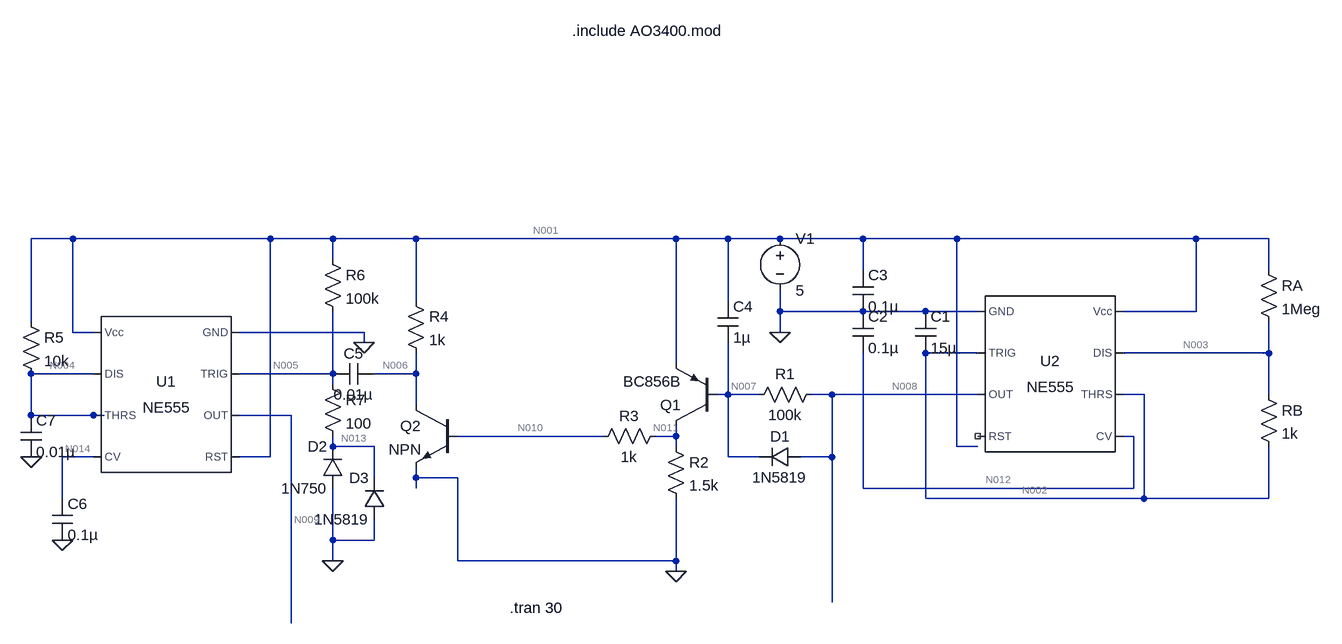
[diagram p0: schematic oscillator.asc]
oscillator.asc, the LTspice schematic file:
Version 4.1
SHEET 1 956 680
WIRE -992 -384 -1056 -384
WIRE -688 -384 -992 -384
WIRE -592 -384 -688 -384
WIRE -464 -384 -592 -384
WIRE -64 -384 -464 -384
WIRE 16 -384 -64 -384
WIRE 96 -384 16 -384
WIRE 224 -384 96 -384
WIRE 368 -384 224 -384
WIRE 736 -384 368 -384
WIRE 848 -384 736 -384
WIRE -592 -352 -592 -384
WIRE 224 -336 224 -384
WIRE 848 -336 848 -384
WIRE -464 -288 -464 -384
WIRE 16 -288 16 -384
WIRE 96 -272 96 -304
WIRE 224 -272 96 -272
WIRE 320 -272 224 -272
WIRE 400 -272 320 -272
WIRE 736 -272 736 -384
WIRE 736 -272 624 -272
WIRE -1056 -256 -1056 -384
WIRE -992 -240 -992 -384
WIRE -960 -240 -992 -240
WIRE -544 -240 -736 -240
WIRE 96 -240 96 -272
WIRE -544 -224 -544 -240
WIRE 400 -208 320 -208
WIRE 848 -208 848 -256
WIRE 848 -208 624 -208
WIRE -64 -192 -64 -384
WIRE -960 -176 -1056 -176
WIRE -592 -176 -592 -272
WIRE -592 -176 -736 -176
WIRE -464 -176 -464 -208
WIRE -464 -176 -528 -176
WIRE -592 -160 -592 -176
WIRE 16 -144 16 -224
WIRE 16 -144 0 -144
WIRE 64 -144 16 -144
WIRE 176 -144 144 -144
WIRE 400 -144 176 -144
WIRE 656 -144 624 -144
WIRE 848 -144 848 -208
WIRE -464 -128 -464 -176
WIRE -1056 -112 -1056 -176
WIRE -960 -112 -1056 -112
WIRE -944 -112 -960 -112
WIRE -656 -112 -736 -112
WIRE -176 -80 -400 -80
WIRE -64 -80 -64 -96
WIRE -64 -80 -96 -80
WIRE 640 -80 624 -80
WIRE -592 -64 -592 -80
WIRE -528 -64 -592 -64
WIRE -64 -64 -64 -80
WIRE 368 -64 368 -384
WIRE 400 -64 368 -64
WIRE -960 -48 -1008 -48
WIRE -688 -48 -688 -384
WIRE -688 -48 -736 -48
WIRE 16 -48 16 -144
WIRE 64 -48 16 -48
WIRE 176 -48 176 -144
WIRE 176 -48 128 -48
WIRE -528 -16 -528 -64
WIRE -464 -16 -464 -32
WIRE -400 -16 -464 -16
WIRE -464 0 -464 -16
WIRE 224 0 224 -208
WIRE 640 0 640 -80
WIRE 640 0 224 0
WIRE -1008 16 -1008 -48
WIRE 320 16 320 -208
WIRE 656 16 656 -144
WIRE 656 16 320 16
WIRE 848 16 848 -64
WIRE 848 16 656 16
WIRE -592 80 -592 0
WIRE -528 80 -528 48
WIRE -528 80 -592 80
WIRE -592 112 -592 80
WIRE -400 112 -400 -16
WIRE -64 112 -64 16
WIRE -64 112 -400 112
WIRE -64 128 -64 112
WIRE 176 176 176 -48
WIRE -656 208 -656 -112
FLAG 96 -240 0
FLAG -64 128 0
FLAG -544 -224 0
FLAG -1008 80 0
FLAG -1056 -48 0
FLAG -592 112 0
SYMBOL Misc\\NE555 512 -176 R0
SYMATTR InstName U2
SYMBOL cap 304 -272 R0
SYMATTR InstName C1
SYMATTR Value 15µ
SYMBOL res 832 -160 R0
SYMATTR InstName RB
SYMATTR Value 1k
SYMBOL res 832 -352 R0
SYMATTR InstName RA
SYMATTR Value 1Meg
SYMBOL cap 208 -272 R0
SYMATTR InstName C2
SYMATTR Value 0.1µ
SYMBOL cap 208 -336 R0
SYMATTR InstName C3
SYMATTR Value 0.1µ
SYMBOL voltage 96 -400 R0
WINDOW 123 0 0 Left 0
WINDOW 39 0 0 Left 0
SYMATTR InstName V1
SYMATTR Value 5
SYMBOL res 160 -160 R90
WINDOW 0 0 56 VBottom 2
WINDOW 3 32 56 VTop 2
SYMATTR InstName R1
SYMATTR Value 100k
SYMBOL cap 0 -288 R0
SYMATTR InstName C4
SYMATTR Value 1µ
SYMBOL res -80 -80 R0
SYMATTR InstName R2
SYMATTR Value 1.5k
SYMBOL pnp 0 -96 R180
SYMATTR InstName Q1
SYMATTR Value BC856B
SYMBOL npn -400 -128 M0
SYMATTR InstName Q2
SYMBOL res -80 -96 R90
WINDOW 0 0 56 VBottom 2
WINDOW 3 32 56 VTop 2
SYMATTR InstName R3
SYMATTR Value 1k
SYMBOL res -480 -304 R0
SYMATTR InstName R4
SYMATTR Value 1k
SYMBOL diode 128 -64 R90
WINDOW 0 0 32 VBottom 2
WINDOW 3 32 32 VTop 2
SYMATTR InstName D1
SYMATTR Value 1N5819
SYMBOL Misc\\NE555 -848 -144 M0
SYMATTR InstName U1
SYMBOL cap -1024 16 R0
SYMATTR InstName C6
SYMATTR Value 0.1µ
SYMBOL res -1072 -272 R0
SYMATTR InstName R5
SYMATTR Value 10k
SYMATTR SpiceLine tol=10
SYMBOL cap -1072 -112 R0
SYMATTR InstName C7
SYMATTR Value 0.01µ
SYMBOL cap -528 -192 R90
WINDOW 0 0 32 VBottom 2
WINDOW 3 32 32 VTop 2
SYMATTR InstName C5
SYMATTR Value 0.01µ
SYMATTR SpiceLine V=4 Irms=162m Rser=0.395426 Lser=0 mfg="KEMET" pn="C0402C103K7PAC" type="X5R"
SYMBOL res -608 -368 R0
SYMATTR InstName R6
SYMATTR Value 100k
SYMATTR SpiceLine tol=10
SYMBOL diode -576 0 R180
WINDOW 0 24 64 Left 2
WINDOW 3 24 0 Left 2
SYMATTR InstName D2
SYMATTR Value 1N750
SYMBOL res -608 -176 R0
SYMATTR InstName R7
SYMATTR Value 100
SYMBOL diode -512 48 R180
WINDOW 0 24 64 Left 2
WINDOW 3 24 0 Left 2
SYMATTR InstName D3
SYMATTR Value 1N5819
SYMATTR Description Diode
SYMATTR Type diode
TEXT -224 -704 Left 2 !.include AO3400.mod
TEXT -320 184 Left 2 !.tran 30

The netlist it stands for:
* oscillator.asc
X§U2 0 N002 N008 NC_01 N012 N002 N003 N001 NE555  ; pins GND TRIG OUT RST CV THRS DIS Vcc
C1 0 N002 15µ
RB N003 N002 1k
RA N001 N003 1Meg
C2 0 N012 0.1µ
C3 N001 0 0.1µ
V1 N001 0 5
R1 N008 N007 100k
C4 N001 N007 1µ
R2 N011 0 1.5k
Q1 N011 N007 N001 0 BC856B
Q2 N006 N010 0 0 NPN
R3 N011 N010 1k
R4 N001 N006 1k
D1 N008 N007 1N5819
X§U1 0 N005 N009 N001 N014 N004 N004 N001 NE555  ; pins GND TRIG OUT RST CV THRS DIS Vcc
C6 N014 0 0.1µ
R5 N001 N004 10k tol=10
C7 N004 0 0.01µ
C5 N006 N005 0.01µ V=4 Irms=162m Rser=0.395426 Lser=0 mfg="KEMET" pn="C0402C103K7PAC" type="X5R"
R6 N001 N005 100k tol=10
D2 0 N013 1N750
R7 N005 N013 100
D3 0 N013 1N5819
.model D D
.lib standard.dio
.model NPN NPN
.model PNP PNP
.lib standard.bjt
.include AO3400.mod
.tran 30
.lib NE555.sub
.backanno
.end

* Results of the author's LTspice run, read from the files saved beside the schematic
* Operating Point, zero values left out:
*   V(n001) = 5 V
*   V(n002) = 4.983 V
*   V(n003) = 4.983 V
*   V(n004) = 5 V
*   V(n005) = 1.737 V
*   V(n006) = 5 V
*   V(n007) = 5 V
*   V(n008) = 5 V
*   V(n009) = 5 V
*   V(n010) = 20.06 nV
*   V(n011) = 15.06 nV
*   V(n012) = 3.333 V
*   V(n013) = 1.734 V
*   V(n014) = 3.333 V
*   I(D1) = 4.963 pA
*   I(D2) = -929.7 nA
*   I(D3) = -31.7 µA
*   I(R2) = 10.04 pA
*   I(R3) = -5 pA
*   I(R4) = 5 pA
*   I(R5) = 11.67 nA
*   I(R6) = 32.63 µA
*   I(R7) = 32.63 µA
*   I(RA) = 16.62 nA
*   I(RB) = 9.967 nA
*   I(V1) = -3.254 mA
*   Ib(Q1) = 5.019 pA
*   Ib(Q2) = -5 pA
*   Ic(Q1) = -5.041 pA
*   Ic(Q2) = 5 pA
*   Ix(u1:1) = -1.611 mA
*   Ix(u1:2) = 1.737 nA
*   Ix(u1:4) = 22.67 µA
*   Ix(u1:6) = 5 nA
*   Ix(u1:7) = 6.672 nA
*   Ix(u1:8) = 1.588 mA
*   Ix(u2:1) = -1.61 mA
*   Ix(u2:2) = 4.983 nA
*   Ix(u2:3) = -5.004 pA
*   Ix(u2:6) = 4.983 nA
*   Ix(u2:7) = 6.649 nA
*   Ix(u2:8) = 1.61 mA
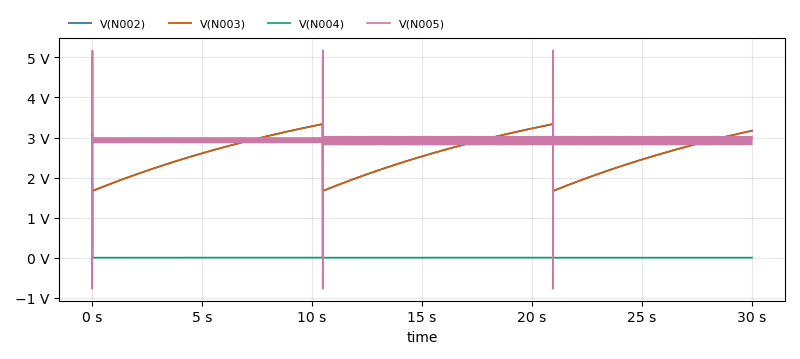
[diagram p1: Transient Analysis of oscillator.asc, plotted from the saved traces]
* Transient Analysis, 1 run:
*   V(N002): min 1.666 V, max 4.983 V, average 2.565 V, rms 2.608 V, last 3.17 V
*   V(N003): min 9.964 mV, max 4.983 V, average 2.564 V, rms 2.608 V, last 3.172 V
*   V(N004): min 2.998 mV, max 5 V, average 3.25 mV, rms 33.83 mV, last 2.998 mV
*   V(N005): min -774 mV, max 5.175 V, average 2.926 V, rms 2.927 V, last 3.022 V